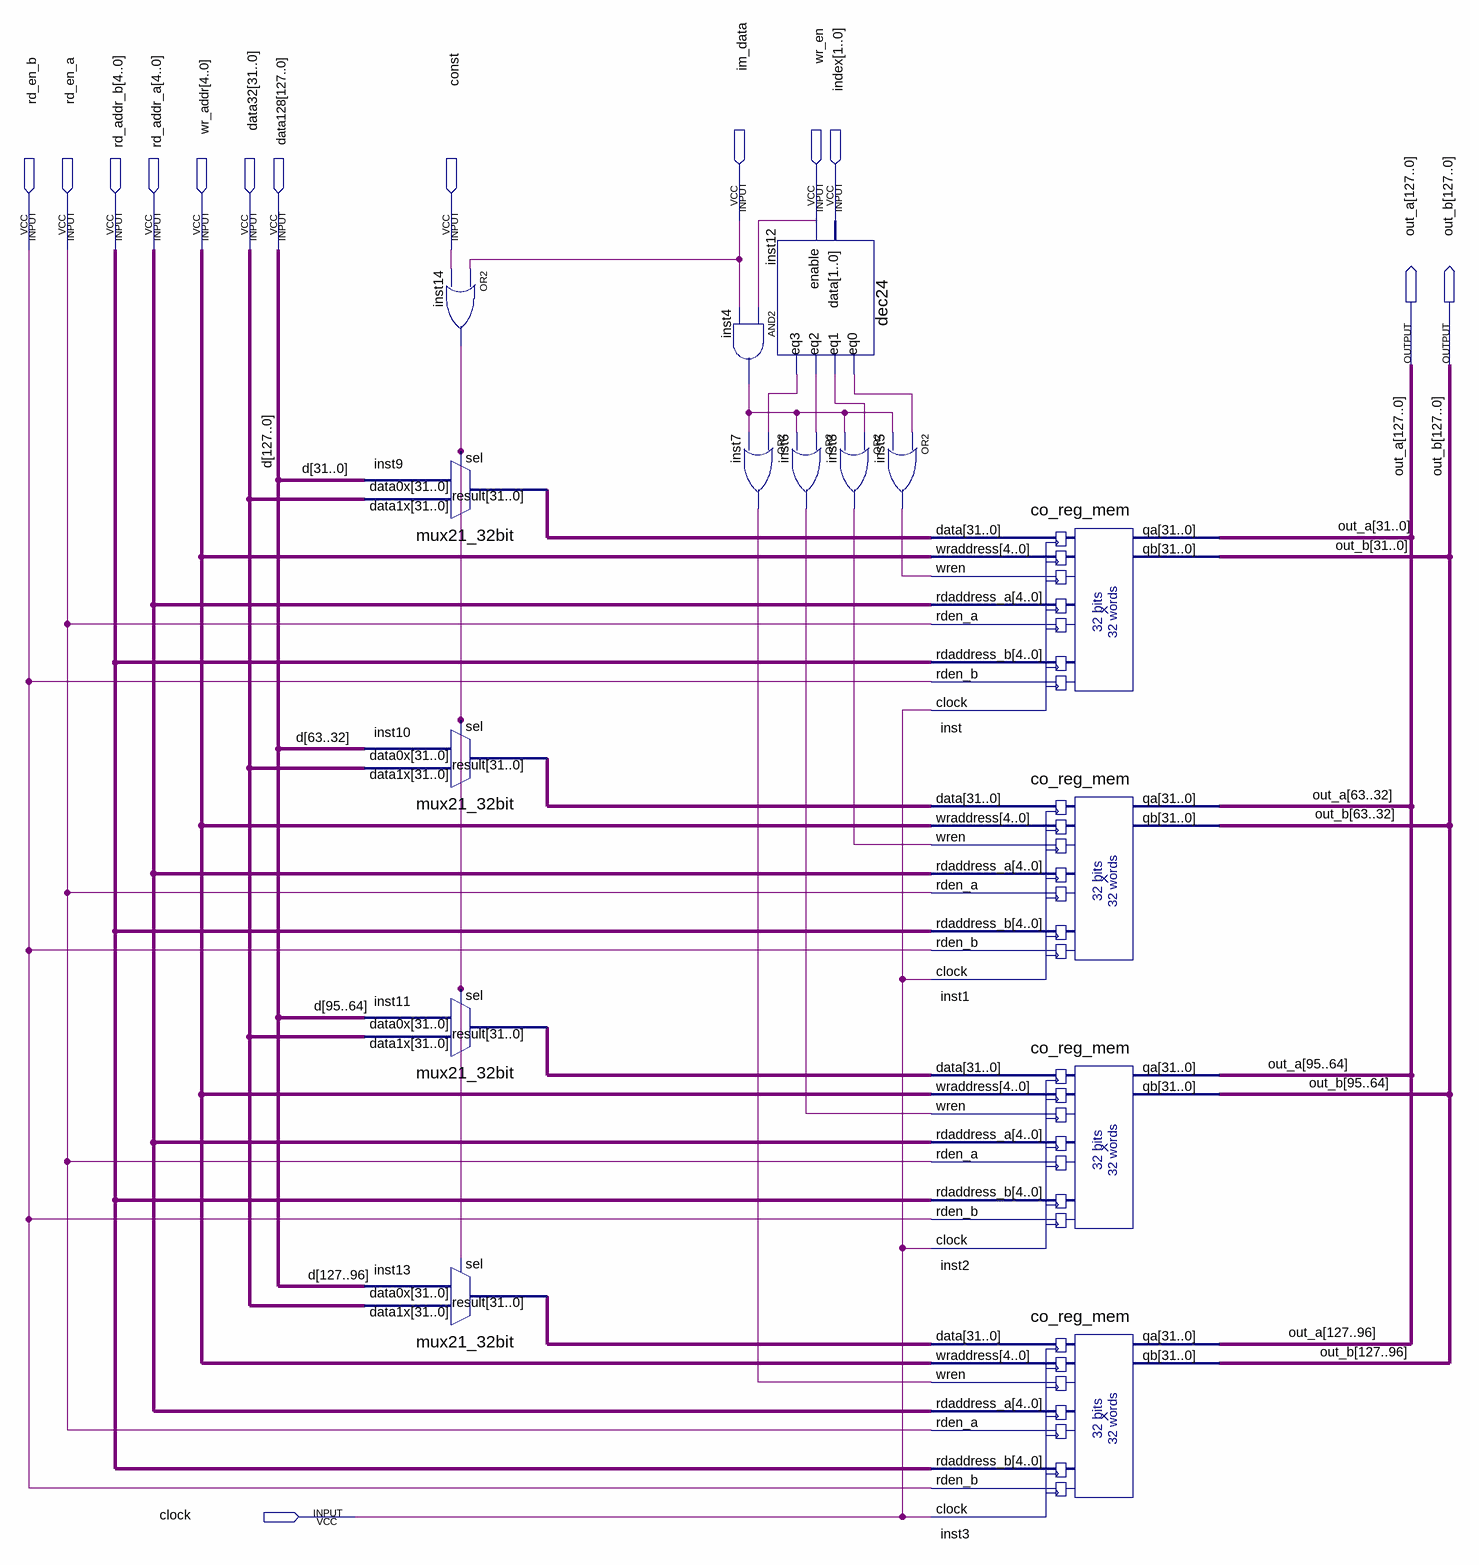
[diagram p0: schematic sheet]
// Quartus schematic co_registers_mem.bdf as structural Verilog: 15 symbols, 14 pins
module co_registers_mem (
  input  im_data,
  input  wr_en,
  input  [1:0] index,
  input  rd_en_b,
  input  rd_en_a,
  input  [4:0] rd_addr_b,
  input  [4:0] rd_addr_a,
  input  [4:0] wr_addr,
  input  [31:0] data32,
  input  [127:0] data128,
  input  \const ,
  input  clock,
  output [127:0] out_a,
  output [127:0] out_b
);

  wire inst4_out, inst5_out, inst6_out, inst7_out, inst8_out, inst12_eq0, inst12_eq1, inst12_eq2, inst12_eq3,
       inst14_out;
  wire [31:0] inst9_result, inst10_result, inst11_result, inst13_result;

  or inst14 (inst14_out, im_data, \const );
  mux21_32bit inst9 (.data1x(data32), .data0x(data128[31:0]), .sel(inst14_out), .result(inst9_result));
  mux21_32bit inst10 (.data1x(data32), .data0x(data128[63:32]), .sel(inst14_out), .result(inst10_result));
  mux21_32bit inst11 (.data1x(data32), .data0x(data128[95:64]), .sel(inst14_out), .result(inst11_result));
  mux21_32bit inst13 (.data1x(data32), .data0x(data128[127:96]), .sel(inst14_out), .result(inst13_result));
  and inst4 (inst4_out, wr_en, im_data);
  or inst7 (inst7_out, inst12_eq3, inst4_out);
  dec24 inst12 (.data(index), .enable(wr_en), .eq0(inst12_eq0), .eq1(inst12_eq1), .eq2(inst12_eq2), .eq3(inst12_eq3));
  or inst6 (inst6_out, inst12_eq2, inst4_out);
  or inst5 (inst5_out, inst12_eq0, inst4_out);
  or inst8 (inst8_out, inst12_eq1, inst4_out);
  co_reg_mem inst (
    .data(inst9_result), .wraddress(wr_addr), .wren(inst5_out), .rdaddress_a(rd_addr_a), .rden_a(rd_en_a),
    .rdaddress_b(rd_addr_b), .rden_b(rd_en_b), .clock(clock), .qa(out_a[31:0]), .qb(out_b[31:0]));
  co_reg_mem inst1 (
    .data(inst10_result), .wraddress(wr_addr), .wren(inst8_out), .rdaddress_a(rd_addr_a), .rden_a(rd_en_a),
    .rdaddress_b(rd_addr_b), .rden_b(rd_en_b), .clock(clock), .qa(out_a[63:32]), .qb(out_b[63:32]));
  co_reg_mem inst2 (
    .data(inst11_result), .wraddress(wr_addr), .wren(inst6_out), .rdaddress_a(rd_addr_a), .rden_a(rd_en_a),
    .rdaddress_b(rd_addr_b), .rden_b(rd_en_b), .clock(clock), .qa(out_a[95:64]), .qb(out_b[95:64]));
  co_reg_mem inst3 (
    .data(inst13_result), .wraddress(wr_addr), .wren(inst7_out), .rdaddress_a(rd_addr_a), .rden_a(rd_en_a),
    .rdaddress_b(rd_addr_b), .rden_b(rd_en_b), .clock(clock), .qa(out_a[127:96]), .qb(out_b[127:96]));

  // Other names for the same wires on the sheet: d[127:0] = data128
endmodule
